# Altium project Numpad_Keyboard.PrjPcb
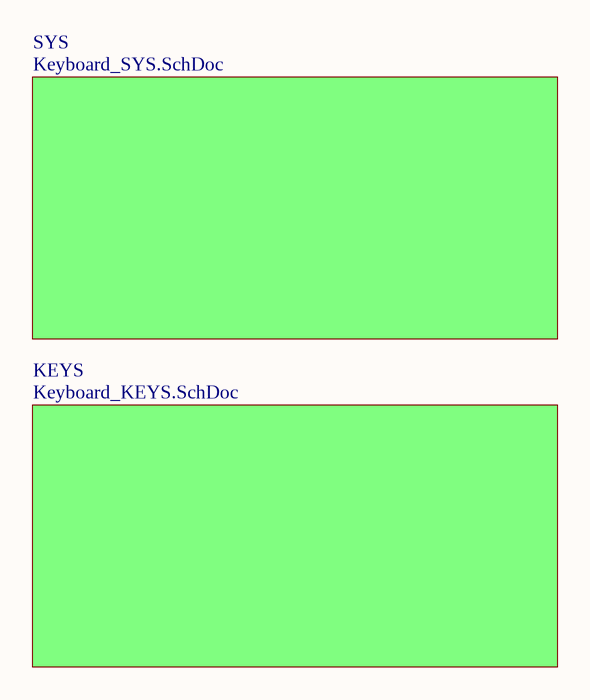
[diagram p0: Keyboard_MAIN.SchDoc]
3 sheets, 78 parts. Net scope: global (net labels, ports and power ports of the same name join across sheets).
Board file: Keyboard.PcbDoc
Sheets:
  Keyboard_MAIN.SchDoc
    SYS = Keyboard_SYS.SchDoc
    KEYS = Keyboard_KEYS.SchDoc

## Sheet Keyboard_MAIN.SchDoc
size A4

### Sub-sheets
KEYS = Keyboard_KEYS.SchDoc: no entries
SYS = Keyboard_SYS.SchDoc: no entries

## Sheet Keyboard_SYS.SchDoc
size A4
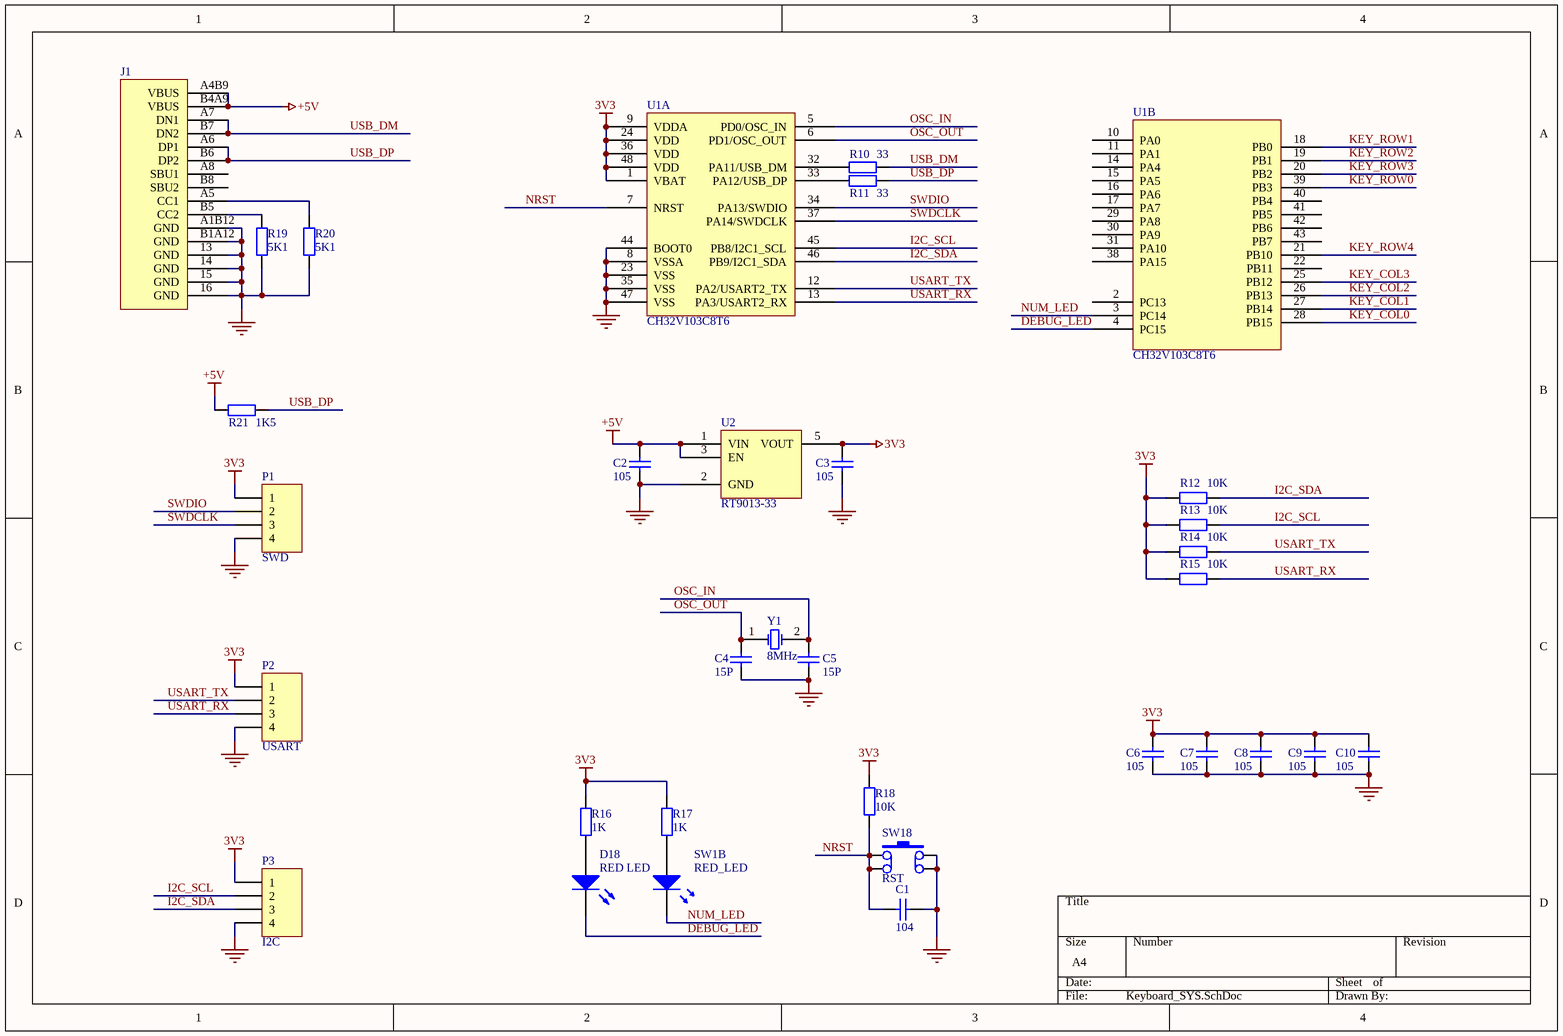
[diagram p1: Keyboard_SYS.SchDoc]

### Parts
C1  104  [C0603]
C2  105  [C0603]
C3  105  [C0603]
C4  15P  [C0603]
C5  15P  [C0603]
C6  105  [C0603]
C7  105  [C0603]
C8  105  [C0603]
C9  105  [C0603]
C10  105  [C0603]
D18  RED LED  [LED0603-RED]
J1  TYPEC-304S-ACP16  [USB-C-SMD_TYPEC-304-BCP16]  (value not drawn)
P1  SWD  [SIP4]
P2  USART  [SIP4]
P3  I2C  [SIP4]
R10  33  [R0603]
R11  33  [R0603]
R12  10K  [R0603]
R13  10K  [R0603]
R14  10K  [R0603]
R15  10K  [R0603]
R16  1K  [R0603]
R17  1K  [R0603]
R18  10K  [R0603]
R19  5K1  [R0603]
R20  5K1  [R0603]
R21  1K5  [R0603]
SW1  RED_LED  [MX_SW-4-1206LED]  (part B of 2)
SW18  RST  [Push Buttom SMD]
U1  CH32V103C8T6  [PQFP48]  (parts A,B of 2)
U2  RT9013-33  [SOT-23-5]
Y1  8MHz  [CY5032]

### Nets
3V3: C3.2 C6.2 C7.2 C8.2 C9.2 C10.2 P1.1 P2.1 P3.1 R12.2 R13.2 R14.2 R15.2 R16.2 R17.2 R18.1 U1.1(VBAT) U1.9(VDDA) U1.24(VDD) U1.36(VDD) U1.48(VDD) U2.5(VOUT)
+5V: C2.2 J1.A4B9(VBUS) J1.B4A9(VBUS) R21.1 U2.1(VIN) U2.3(EN)
GND: C1.1 C2.1 C3.1 C4.1 C5.1 C6.1 C7.1 C8.1 C9.1 C10.1 J1.13(GND) J1.14(GND) J1.15(GND) J1.16(GND) J1.A1B12(GND) J1.B1A12(GND) P1.4 P2.4 P3.4 R19.2 R20.2 SW18.3 SW18.4 U1.8(VSSA) U1.23(VSS) U1.35(VSS) U1.44(BOOT0) U1.47(VSS) U2.2(GND)
DEBUG_LED: D18.2(K) U1.4(PC15)
I2C_SCL: P3.2 R13.1 U1.45(PB8/I2C1_SCL)
I2C_SDA: P3.3 R12.1 U1.46(PB9/I2C1_SDA)
KEY_COL0: U1.28(PB15)
KEY_COL1: U1.27(PB14)
KEY_COL2: U1.26(PB13)
KEY_COL3: U1.25(PB12)
KEY_ROW0: U1.39(PB3)
KEY_ROW1: U1.18(PB0)
KEY_ROW2: U1.19(PB1)
KEY_ROW3: U1.20(PB2)
KEY_ROW4: U1.21(PB10)
NRST: C1.2 R18.2 SW18.1 SW18.2 U1.7(NRST)
NUM_LED: SW1.4 U1.3(PC14)
OSC_IN: C5.2 U1.5(PD0/OSC_IN) Y1.2(OSC2)
OSC_OUT: C4.2 U1.6(PD1/OSC_OUT) Y1.1(OSC1)
SWDCLK: P1.3 U1.37(PA14/SWDCLK)
SWDIO: P1.2 U1.34(PA13/SWDIO)
USART_RX: P2.3 R15.1 U1.13(PA3/USART2_RX)
USART_TX: P2.2 R14.1 U1.12(PA2/USART2_TX)
USB_DM: J1.A7(DN1) J1.B7(DN2) R10.2
USB_DP: J1.A6(DP1) J1.B6(DP2) R11.2 R21.2
NetD18_1: D18.1(A) R16.1
NetJ1_A5: J1.A5(CC1) R20.1
NetJ1_B5: J1.B5(CC2) R19.1
NetR10_1: R10.1 U1.32(PA11/USB_DM)
NetR11_1: R11.1 U1.33(PA12/USB_DP)
NetR17_1: R17.1 SW1.3

Not connected (* = marked no-connect by the designer): J1 A8(SBU1) B8(SBU2); U1 2(PC13) 10(PA0) 11(PA1) 14(PA4) 15(PA5) 16(PA6) 17(PA7) 22(PB11) 29(PA8) 30(PA9) 31(PA10) 38(PA15) 40(PB4) 41(PB5) 42(PB6) 43(PB7); U2 4(NC)

### Library data of the parts
C1 = Cap Semi: Capacitor (Semiconductor SIM Model); Published: 8-Jun-2000; LatestRevisionDate: 29-May-2009; LatestRevisionNote: IPC-7351 Footprint Added.; PackageReference: C1206; Publisher: Altium Limited; PackageDescription: Chip Capacitor; Value: 104
C2-C10 = Cap Semi: Capacitor (Semiconductor SIM Model); Value: 104; Published: 8-Jun-2000; LatestRevisionDate: 29-May-2009; LatestRevisionNote: IPC-7351 Footprint Added.; PackageReference: C1206; Publisher: Altium Limited; PackageDescription: Chip Capacitor
D18 = LED2: Typical RED, GREEN, YELLOW, AMBER GaAs LED; Published: 8-Jun-2000; LatestRevisionDate: 17-Jul-2002; LatestRevisionNote: Re-released for DXP Platform.; PackageVersion: Feb-2002; PackageReference: 3.2X1.6X1.1; Publisher: Altium Limited; PackageDescription: SM LED; 2 Flat Leads
P1-P3 = Header 4: Header, 4-Pin; LatestRevisionDate: 17-Jul-2002; LatestRevisionNote: Re-released for DXP Platform.; Publisher: Altium Limited
R10-R15 R18-R21 = Res2: Resistor; Value: 1K; Published: 8-Jun-2000; LatestRevisionDate: 17-Jul-2002; LatestRevisionNote: Re-released for DXP Platform.; PackageReference: AXIAL-0.4; Publisher: Altium Limited; PackageDescription: Axial Device, Thru-Hole; 2 Leads; 0.4 in Pin Spacing
R16 R17 = Res2: Resistor; Published: 8-Jun-2000; LatestRevisionDate: 17-Jul-2002; LatestRevisionNote: Re-released for DXP Platform.; PackageReference: AXIAL-0.4; Publisher: Altium Limited; PackageDescription: Axial Device, Thru-Hole; 2 Leads; 0.4 in Pin Spacing; Value: 1K
SW1 = MX_SW-4-1206LED
SW18 = Push Buttom
U1 = STM32F103C8Tx: STM32F103C8Tx series arm mcu
U2 = RT9013-33: RT9013 3.3V  LDO Regulator
Y1 = XTAL: Crystal Oscillator; Published: 8-Jun-2000; LatestRevisionDate: 17-Jul-2002; LatestRevisionNote: Re-released for DXP Platform.; PackageReference: R38; Publisher: Altium Limited; PackageDescription: Crystal, Thru-Hole; 2 Leads; Body 3.1 x 8.2 mm (Dia.xH)

## Sheet Keyboard_KEYS.SchDoc
size A4
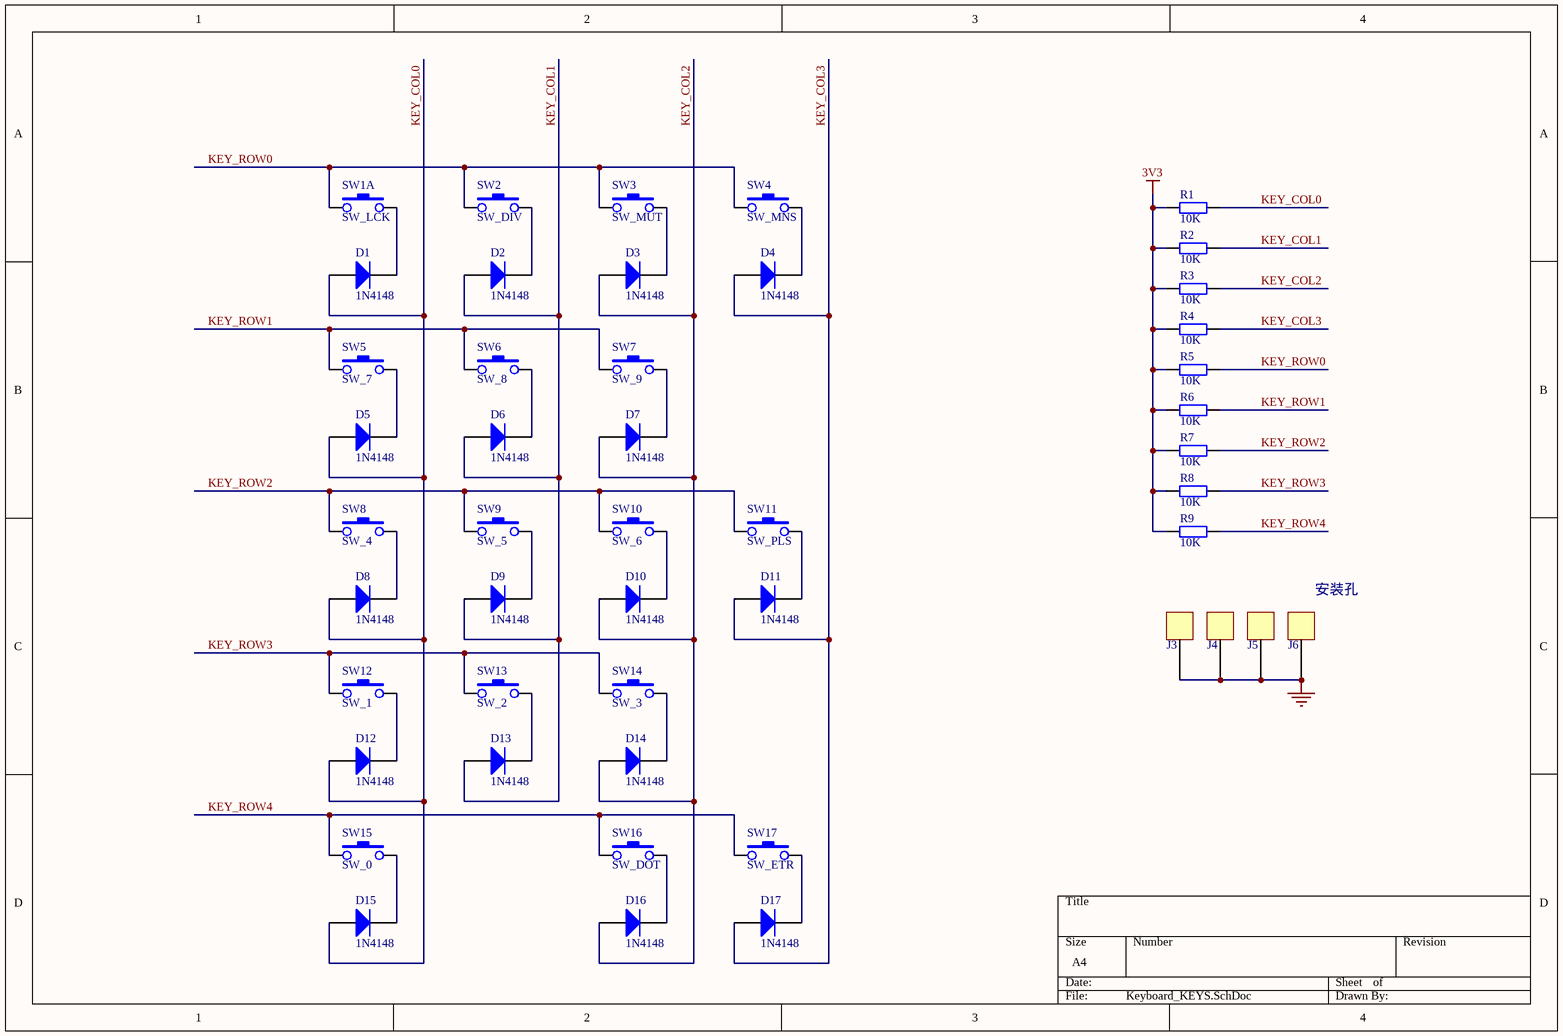
[diagram p2: Keyboard_KEYS.SchDoc]

### Parts
D1  1N4148  [SOD80]
D2  1N4148  [SOD80]
D3  1N4148  [SOD80]
D4  1N4148  [SOD80]
D5  1N4148  [SOD80]
D6  1N4148  [SOD80]
D7  1N4148  [SOD80]
D8  1N4148  [SOD80]
D9  1N4148  [SOD80]
D10  1N4148  [SOD80]
D11  1N4148  [SOD80]
D12  1N4148  [SOD80]
D13  1N4148  [SOD80]
D14  1N4148  [SOD80]
D15  1N4148  [SOD80]
D16  1N4148  [SOD80]
D17  1N4148  [SOD80]
J3  Hole  [PADR3/4]  (value not drawn)
J4  Hole  [PADR3/4]  (value not drawn)
J5  Hole  [PADR3/4]  (value not drawn)
J6  Hole  [PADR3/4]  (value not drawn)
R1  10K  [R0603]
R2  10K  [R0603]
R3  10K  [R0603]
R4  10K  [R0603]
R5  10K  [R0603]
R6  10K  [R0603]
R7  10K  [R0603]
R8  10K  [R0603]
R9  10K  [R0603]
SW1  SW_LCK  [MX_SW-4-1206LED]  (part A of 2)
SW2  SW_DIV  [MX_SW-4]
SW3  SW_MUT  [MX_SW-4]
SW4  SW_MNS  [MX_SW-4]
SW5  SW_7  [MX_SW-4]
SW6  SW_8  [MX_SW-4]
SW7  SW_9  [MX_SW-4]
SW8  SW_4  [MX_SW-4]
SW9  SW_5  [MX_SW-4]
SW10  SW_6  [MX_SW-4]
SW11  SW_PLS  [MX_SW-4_1x2_r]
SW12  SW_1  [MX_SW-4]
SW13  SW_2  [MX_SW-4]
SW14  SW_3  [MX_SW-4]
SW15  SW_0  [MX_SW-4_1x2]
SW16  SW_DOT  [MX_SW-4]
SW17  SW_ETR  [MX_SW-4_1x2_r]

### Nets
3V3: R1.1 R2.1 R3.1 R4.1 R5.1 R6.1 R7.1 R8.1 R9.1
GND: J3.1 J4.1 J5.1 J6.1
KEY_COL0: D1.1(A) D5.1(A) D8.1(A) D12.1(A) D15.1(A) R1.2
KEY_COL1: D2.1(A) D6.1(A) D9.1(A) D13.1(A) R2.2
KEY_COL2: D3.1(A) D7.1(A) D10.1(A) D14.1(A) D16.1(A) R3.2
KEY_COL3: D4.1(A) D11.1(A) D17.1(A) R4.2
KEY_ROW0: R5.2 SW1.1 SW2.1 SW3.1 SW4.1
KEY_ROW1: R6.2 SW5.1 SW6.1 SW7.1
KEY_ROW2: R7.2 SW8.1 SW9.1 SW10.1 SW11.1
KEY_ROW3: R8.2 SW12.1 SW13.1 SW14.1
KEY_ROW4: R9.2 SW15.1 SW16.1 SW17.1
NetD1_2: D1.2(K) SW1.2
NetD2_2: D2.2(K) SW2.2
NetD3_2: D3.2(K) SW3.2
NetD4_2: D4.2(K) SW4.2
NetD5_2: D5.2(K) SW5.2
NetD6_2: D6.2(K) SW6.2
NetD7_2: D7.2(K) SW7.2
NetD8_2: D8.2(K) SW8.2
NetD9_2: D9.2(K) SW9.2
NetD10_2: D10.2(K) SW10.2
NetD11_2: D11.2(K) SW11.2
NetD12_2: D12.2(K) SW12.2
NetD13_2: D13.2(K) SW13.2
NetD14_2: D14.2(K) SW14.2
NetD15_2: D15.2(K) SW15.2
NetD16_2: D16.2(K) SW16.2
NetD17_2: D17.2(K) SW17.2

### Notes on the sheet
- 安装孔

### Library data of the parts
D1-D17 = Diode: Default Diode
R1-R9 = Res2: Resistor; Value: 1K; Published: 8-Jun-2000; LatestRevisionDate: 17-Jul-2002; LatestRevisionNote: Re-released for DXP Platform.; PackageReference: AXIAL-0.4; Publisher: Altium Limited; PackageDescription: Axial Device, Thru-Hole; 2 Leads; 0.4 in Pin Spacing
SW1 = MX_SW-4-1206LED
SW2-SW17 = Push Buttom_2

## Nets that join several sheets
3V3: Keyboard_SYS (22 pins), Keyboard_KEYS (9 pins)
GND: Keyboard_SYS (29 pins), Keyboard_KEYS (J3.1 J4.1 J5.1 J6.1)
KEY_COL0: Keyboard_SYS (U1.28), Keyboard_KEYS (6 pins)
KEY_COL1: Keyboard_SYS (U1.27), Keyboard_KEYS (5 pins)
KEY_COL2: Keyboard_SYS (U1.26), Keyboard_KEYS (6 pins)
KEY_COL3: Keyboard_SYS (U1.25), Keyboard_KEYS (D4.1 D11.1 D17.1 R4.2)
KEY_ROW0: Keyboard_SYS (U1.39), Keyboard_KEYS (5 pins)
KEY_ROW1: Keyboard_SYS (U1.18), Keyboard_KEYS (R6.2 SW5.1 SW6.1 SW7.1)
KEY_ROW2: Keyboard_SYS (U1.19), Keyboard_KEYS (5 pins)
KEY_ROW3: Keyboard_SYS (U1.20), Keyboard_KEYS (R8.2 SW12.1 SW13.1 SW14.1)
KEY_ROW4: Keyboard_SYS (U1.21), Keyboard_KEYS (R9.2 SW15.1 SW16.1 SW17.1)